# Altium schematic sheet Main Board Motor Control.SchDoc
size C; SheetNumber: 1; SheetTotal: 1
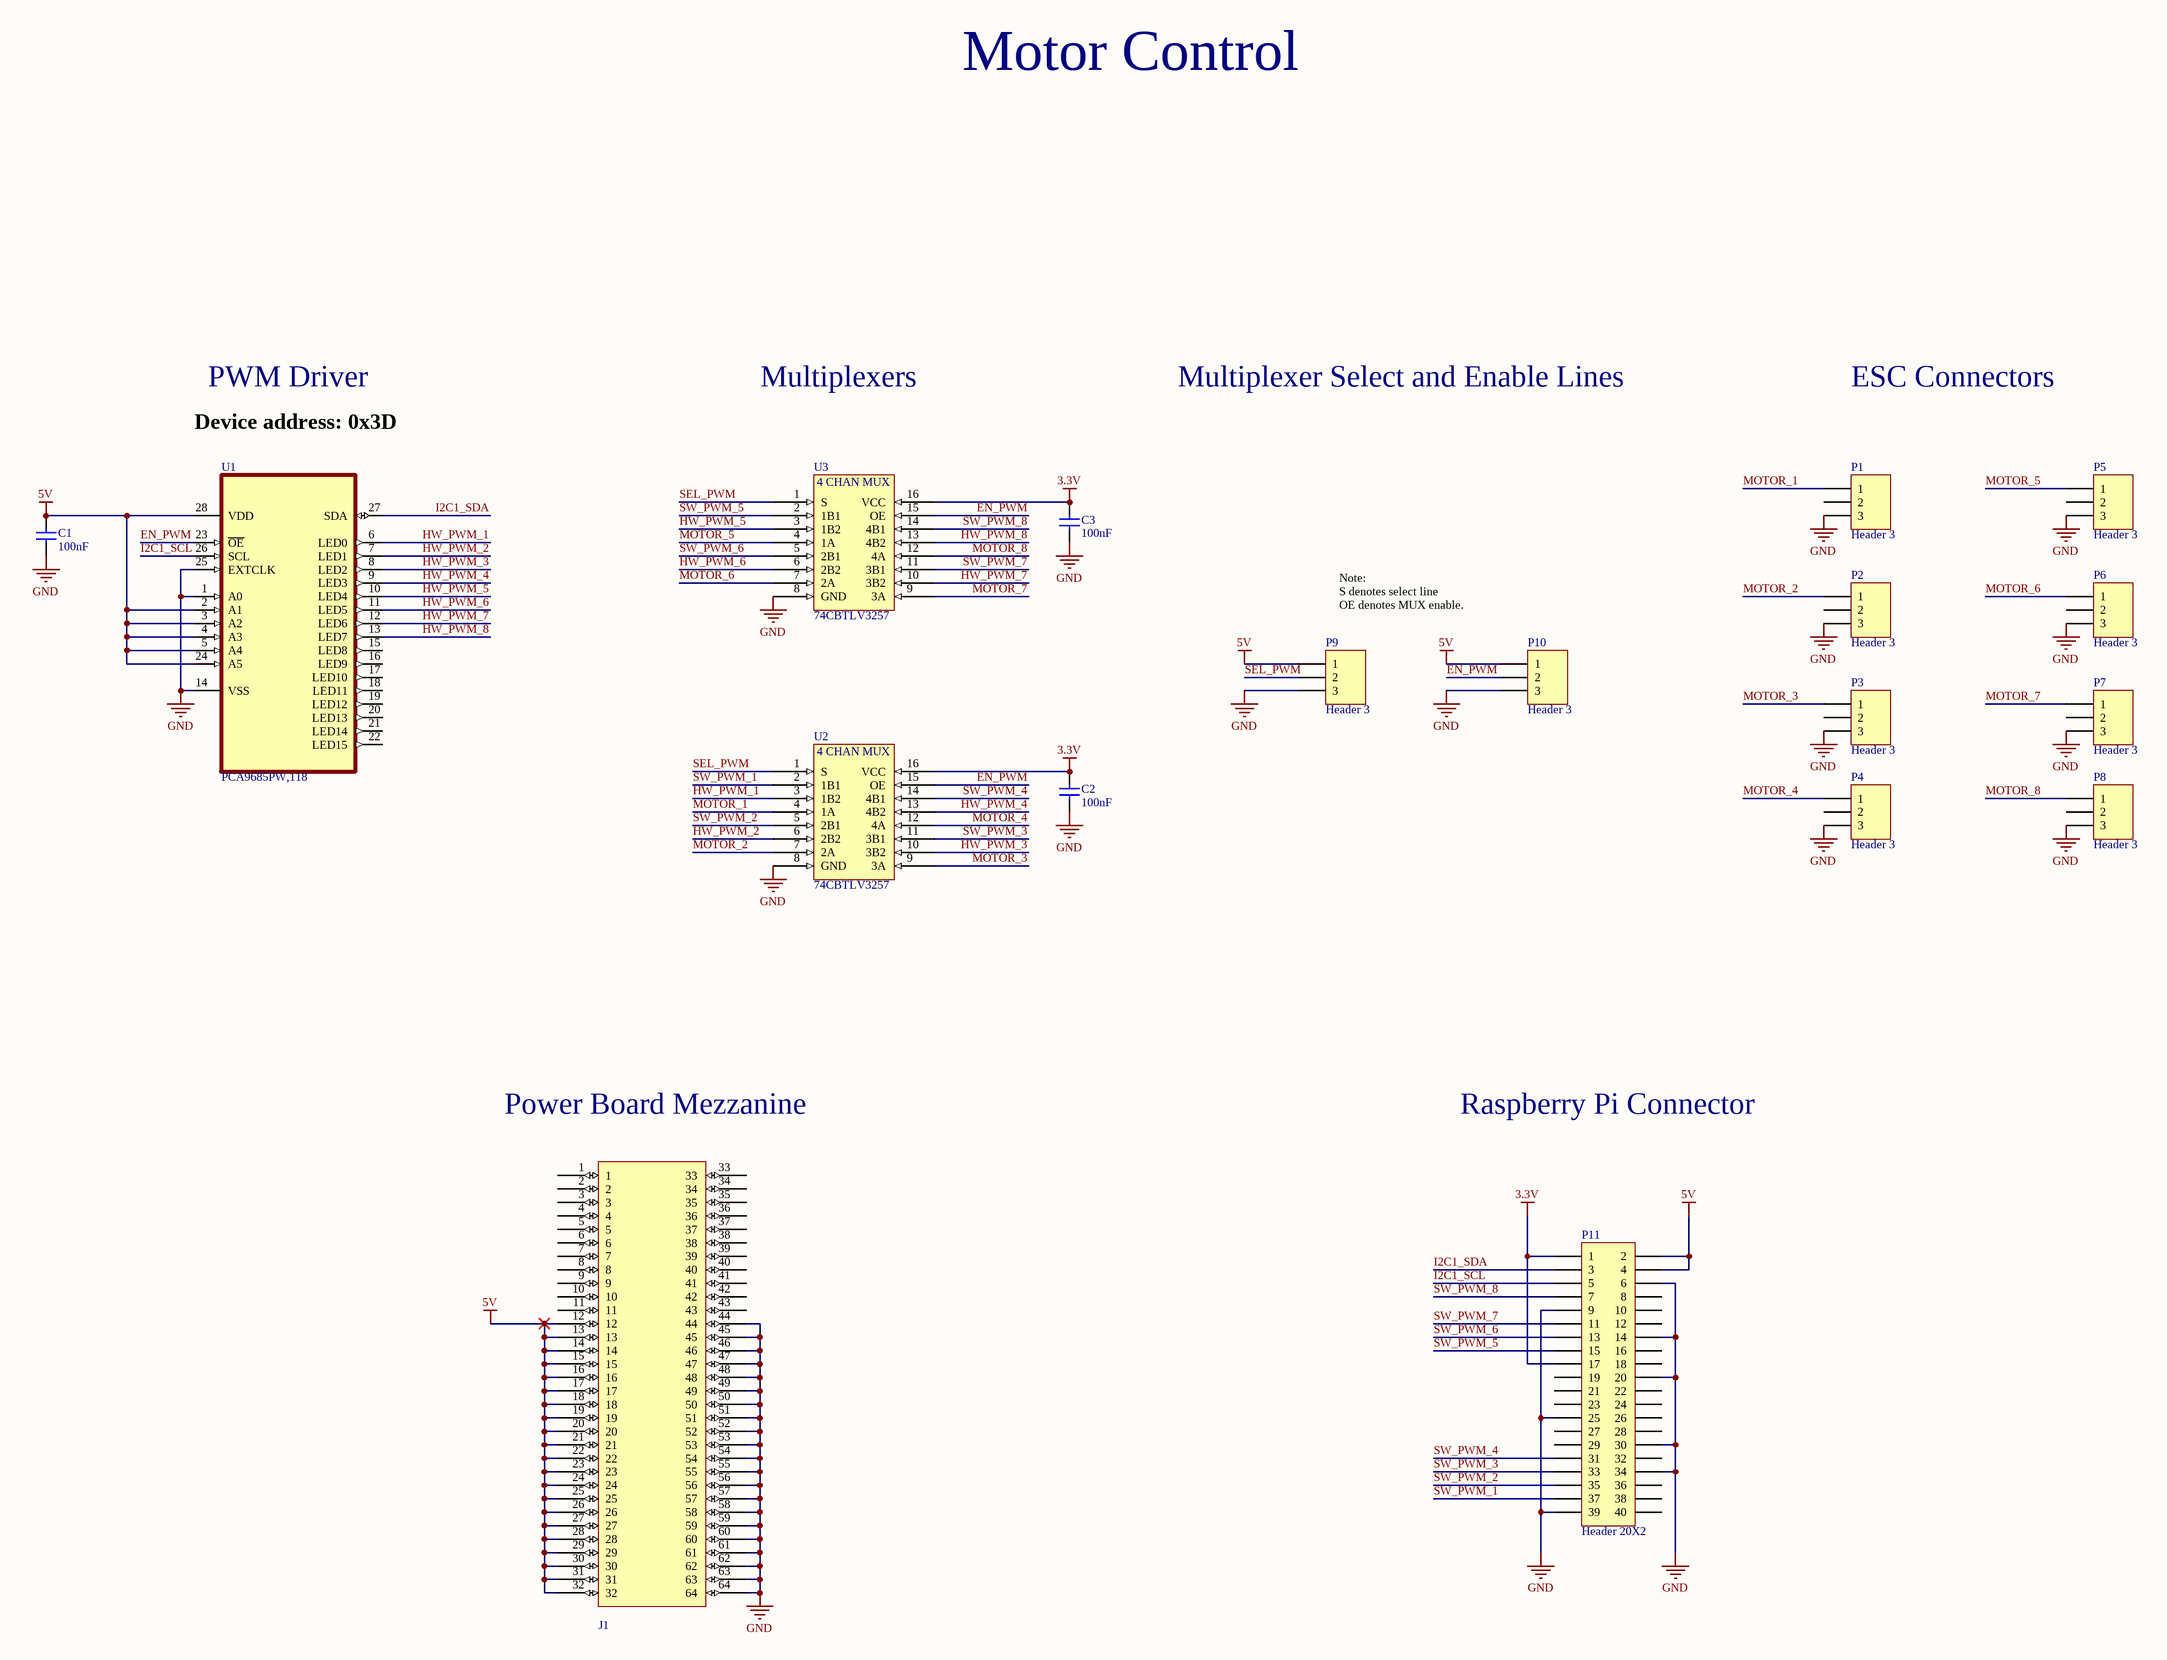
[diagram p0: Main Board Motor Control.SchDoc]

## Parts
C1  value 100nF  [CAPC0603]  (hidden comment: CL10B104KB8NNNC)
C2  value 100nF  [CAPC0603]  (hidden comment: CL10B104KB8NNNC)
C3  value 100nF  [CAPC0603]  (hidden comment: CL10B104KB8NNNC)
J1  0714362164  [1.0mm mezzanine connector 64 pin]  (value not drawn)
P1  Header 3  [HDR1X3]
P2  Header 3  [HDR1X3]
P3  Header 3  [HDR1X3]
P4  Header 3  [HDR1X3]
P5  Header 3  [HDR1X3]
P6  Header 3  [HDR1X3]
P7  Header 3  [HDR1X3]
P8  Header 3  [HDR1X3]
P9  Header 3  [HDR1X3]
P10  Header 3  [HDR1X3]
P11  Header 20X2  [HDR2X20]
U1  PCA9685PW,118  [SOP65P640X110-28N]
U2  74CBTLV3257  [TSSOP16]
U3  74CBTLV3257  [TSSOP16]

## Nets
3.3V: C2.1(A) C3.1(A) P11.1 P11.17 U2.16(VCC) U3.16(VCC)
5V: C1.1(A) J1.12 J1.13 J1.14 J1.15 J1.16 J1.17 J1.18 J1.19 J1.20 J1.21 J1.22 J1.23 J1.24 J1.25 J1.26 J1.27 J1.28 J1.29 J1.30 J1.31 J1.32 P9.1 P10.1 P11.2 P11.4 U1.2(A1) U1.3(A2) U1.4(A3) U1.5(A4) U1.24(A5) U1.28(VDD)
GND: C1.2(B) C2.2(B) C3.2(B) J1.44 J1.45 J1.46 J1.47 J1.48 J1.49 J1.50 J1.51 J1.52 J1.53 J1.54 J1.55 J1.56 J1.57 J1.58 J1.59 J1.60 J1.61 J1.62 J1.63 J1.64 P1.3 P2.3 P3.3 P4.3 P5.3 P6.3 P7.3 P8.3 P9.3 P10.3 P11.6 P11.9 P11.14 P11.20 P11.25 P11.30 P11.34 P11.39 U1.1(A0) U1.14(VSS) U1.25(EXTCLK) U2.8(GND) U3.8(GND)
EN_PWM: P10.2 U1.23(~{OE}) U2.15(OE) U3.15(OE)
HW_PWM_1: U1.6(LED0) U2.3(1B2)
HW_PWM_2: U1.7(LED1) U2.6(2B2)
HW_PWM_3: U1.8(LED2) U2.10(3B2)
HW_PWM_4: U1.9(LED3) U2.13(4B2)
HW_PWM_5: U1.10(LED4) U3.3(1B2)
HW_PWM_6: U1.11(LED5) U3.6(2B2)
HW_PWM_7: U1.12(LED6) U3.10(3B2)
HW_PWM_8: U1.13(LED7) U3.13(4B2)
I2C1_SCL: P11.5 U1.26(SCL)
I2C1_SDA: P11.3 U1.27(SDA)
MOTOR_1: P1.1 U2.4(1A)
MOTOR_2: P2.1 U2.7(2A)
MOTOR_3: P3.1 U2.9(3A)
MOTOR_4: P4.1 U2.12(4A)
MOTOR_5: P5.1 U3.4(1A)
MOTOR_6: P6.1 U3.7(2A)
MOTOR_7: P7.1 U3.9(3A)
MOTOR_8: P8.1 U3.12(4A)
SEL_PWM: P9.2 U2.1(S) U3.1(S)
SW_PWM_1: P11.37 U2.2(1B1)
SW_PWM_2: P11.35 U2.5(2B1)
SW_PWM_3: P11.33 U2.11(3B1)
SW_PWM_4: P11.31 U2.14(4B1)
SW_PWM_5: P11.15 U3.2(1B1)
SW_PWM_6: P11.13 U3.5(2B1)
SW_PWM_7: P11.11 U3.11(3B1)
SW_PWM_8: P11.7 U3.14(4B1)

Not connected (* = marked no-connect by the designer): J1 1 2 3 4 5 6 7 8 9 10 11 33 34 35 36 37 38 39 40 41 42 43; P1 2; P2 2; P3 2; P4 2; P5 2; P6 2; P7 2; P8 2; P11 8 10 12 16 18 19 21 22 23 24 26 27 28 29 32 36 38 40; U1 15(LED8) 16(LED9) 17(LED10) 18(LED11) 19(LED12) 20(LED13) 21(LED14) 22(LED15)

## Notes on the sheet
- Motor Control
- PWM Driver
- Multiplexers
- Multiplexer Select and Enable Lines
- ESC Connectors
- Device address: 0x3D
- Note:
  S denotes select line
  OE denotes MUX enable.
- Power Board Mezzanine
- Raspberry Pi Connector
- (in symbol 74CBTLV3257) 4 CHAN MUX

## Library data of the parts
C1-C3 = CL10B104KB8NNNC: 0.1 µF ±10% 50V Ceramic Capacitor X7R 0603 (1608 Metric); Supplier 1: Arrow Electronics; Supplier Part Number 1: CL10B104KB8NNNC; ComponentLink1Description: New link; ComponentLink1URL: *
J1 = 0714362164: 64 Position Connector Plug, Center Strip Contacts Surface Mount Gold
P1-P10 = Header 3: Header, 3-Pin; LatestRevisionDate: 17-Jul-2002; LatestRevisionNote: Re-released for DXP Platform.; Publisher: Altium Limited
P11 = Header 20X2: Header, 20-Pin, Dual row; LatestRevisionDate: 17-Jul-2002; LatestRevisionNote: Re-released for DXP Platform.; Publisher: Altium Limited
U1 = PCA9685PW,118: LED Driver IC 16 Output Linear - PWM Dimming 25mA 28-TSSOP; MF: NXP USA; Value: *; MP: PCA9685PW,118; Purchase-URL: https://pricing.snapeda.com/search/part/PCA9685PW,118/?ref=eda; Availability: In Stock; Price: None; Package: TSSOP-28 NXP Semiconductors
U2 U3 = 74CBTLV3257: Mux; 4 channel; 2:1; Demux; Supplier 1: Digi-Key; Supplier Part Number 1: 1727-4410-1-ND